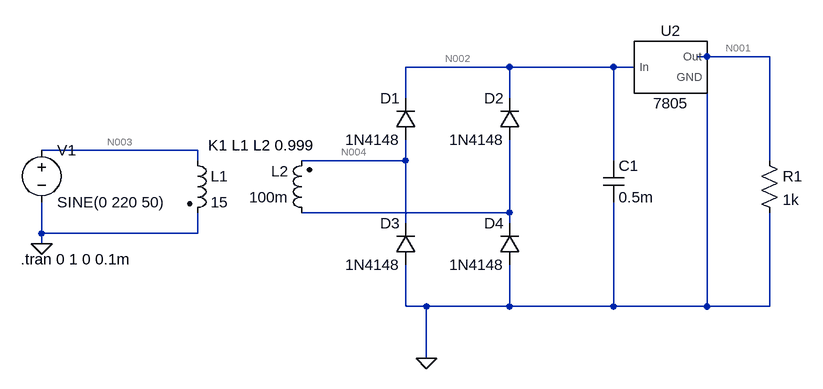
[diagram p0: schematic Power_supply_example_OK.asc]
Power_supply_example_OK.asc, the LTspice schematic file:
Version 4
SHEET 1 1588 680
WIRE 1056 80 1040 80
WIRE 1152 80 1056 80
WIRE 752 96 592 96
WIRE 912 96 752 96
WIRE 944 96 912 96
WIRE 592 144 592 96
WIRE 752 144 752 96
WIRE 272 224 32 224
WIRE 272 240 272 224
WIRE 592 240 592 208
WIRE 592 240 432 240
WIRE 912 240 912 96
WIRE 1152 240 1152 80
WIRE 752 320 752 208
WIRE 752 320 432 320
WIRE 592 336 592 240
WIRE 752 336 752 320
WIRE 32 352 32 304
WIRE 272 352 272 320
WIRE 272 352 32 352
WIRE 32 368 32 352
WIRE 592 464 592 400
WIRE 624 464 592 464
WIRE 752 464 752 400
WIRE 752 464 624 464
WIRE 912 464 912 304
WIRE 912 464 752 464
WIRE 1056 464 1056 112
WIRE 1056 464 912 464
WIRE 1152 464 1152 320
WIRE 1152 464 1056 464
WIRE 624 544 624 464
FLAG 32 368 0
FLAG 624 544 0
SYMBOL voltage 32 208 R0
WINDOW 123 0 0 Left 0
WINDOW 39 0 0 Left 0
SYMATTR InstName V1
SYMATTR Value SINE(0 220 50)
SYMBOL res 1136 224 R0
SYMATTR InstName R1
SYMATTR Value 1k
SYMBOL ind2 256 224 R0
SYMATTR InstName L1
SYMATTR Value 15
SYMATTR Type ind
SYMATTR SpiceLine Rser=1
SYMBOL ind2 448 336 R180
WINDOW 0 36 80 Left 2
WINDOW 3 36 40 Left 2
SYMATTR InstName L2
SYMATTR Value 100m
SYMATTR Type ind
SYMATTR SpiceLine Rser=1m
SYMBOL diode 608 208 R180
WINDOW 0 24 64 Left 2
WINDOW 3 24 0 Left 2
SYMATTR InstName D1
SYMATTR Value 1N4148
SYMBOL diode 768 208 R180
WINDOW 0 24 64 Left 2
WINDOW 3 24 0 Left 2
SYMATTR InstName D2
SYMATTR Value 1N4148
SYMBOL diode 608 400 R180
WINDOW 0 24 64 Left 2
WINDOW 3 24 0 Left 2
SYMATTR InstName D3
SYMATTR Value 1N4148
SYMBOL diode 768 400 R180
WINDOW 0 24 64 Left 2
WINDOW 3 24 0 Left 2
SYMATTR InstName D4
SYMATTR Value 1N4148
SYMBOL cap 896 240 R0
SYMATTR InstName C1
SYMATTR Value 0.5m
SYMBOL AutoGenerated\\7805 992 96 R0
SYMATTR InstName U2
TEXT 0 392 Left 2 !.tran 0 1 0 0.1m
TEXT 288 216 Left 2 !K1 L1 L2 0.999

The netlist it stands for:
* Power_supply_example_OK.asc
V1 N003 0 SINE(0 220 50)
R1 N001 0 1k
L1 N003 0 15 Rser=1
L2 N005 N004 100m Rser=1m
D1 N004 N002 1N4148
D2 N005 N002 1N4148
D3 0 N004 1N4148
D4 0 N005 1N4148
C1 N002 0 0.5m
XU2 N002 0 N001 7805  ; pins In GND Out
.model D D
.lib standard.dio
.tran 0 1 0 0.1m
K1 L1 L2 0.999
.lib C:\Users\49152\Desktop\HSLH\WS_2022\regulators.lib
.backanno
.end

* Results of the author's LTspice run, read from the files saved beside the schematic
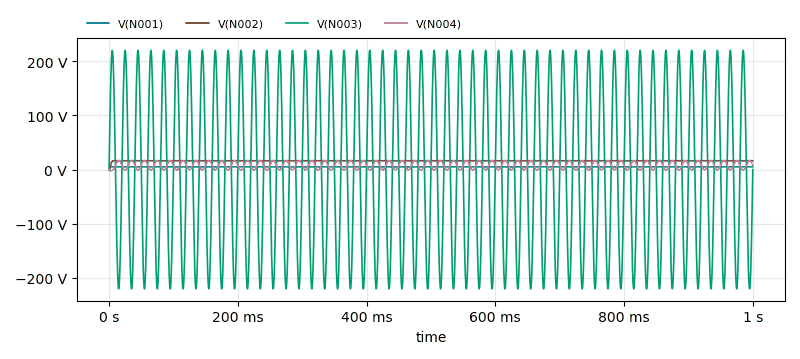
[diagram p1: Transient Analysis of Power_supply_example_OK.asc, plotted from the saved traces]
* Transient Analysis, 1 run:
*   V(N001): min 0 V, max 5 V, average 4.992 V, rms 4.995 V, last 5 V
*   V(N002): min 0 V, max 16.35 V, average 16.26 V, rms 16.28 V, last 16.31 V
*   V(N003): min -220 V, max 220 V, average 15.76 mV, rms 155.7 V, last 0 V
*   V(N004): min -2.357 V, max 17.14 V, average 8.131 V, rms 10.33 V, last 8.154 V